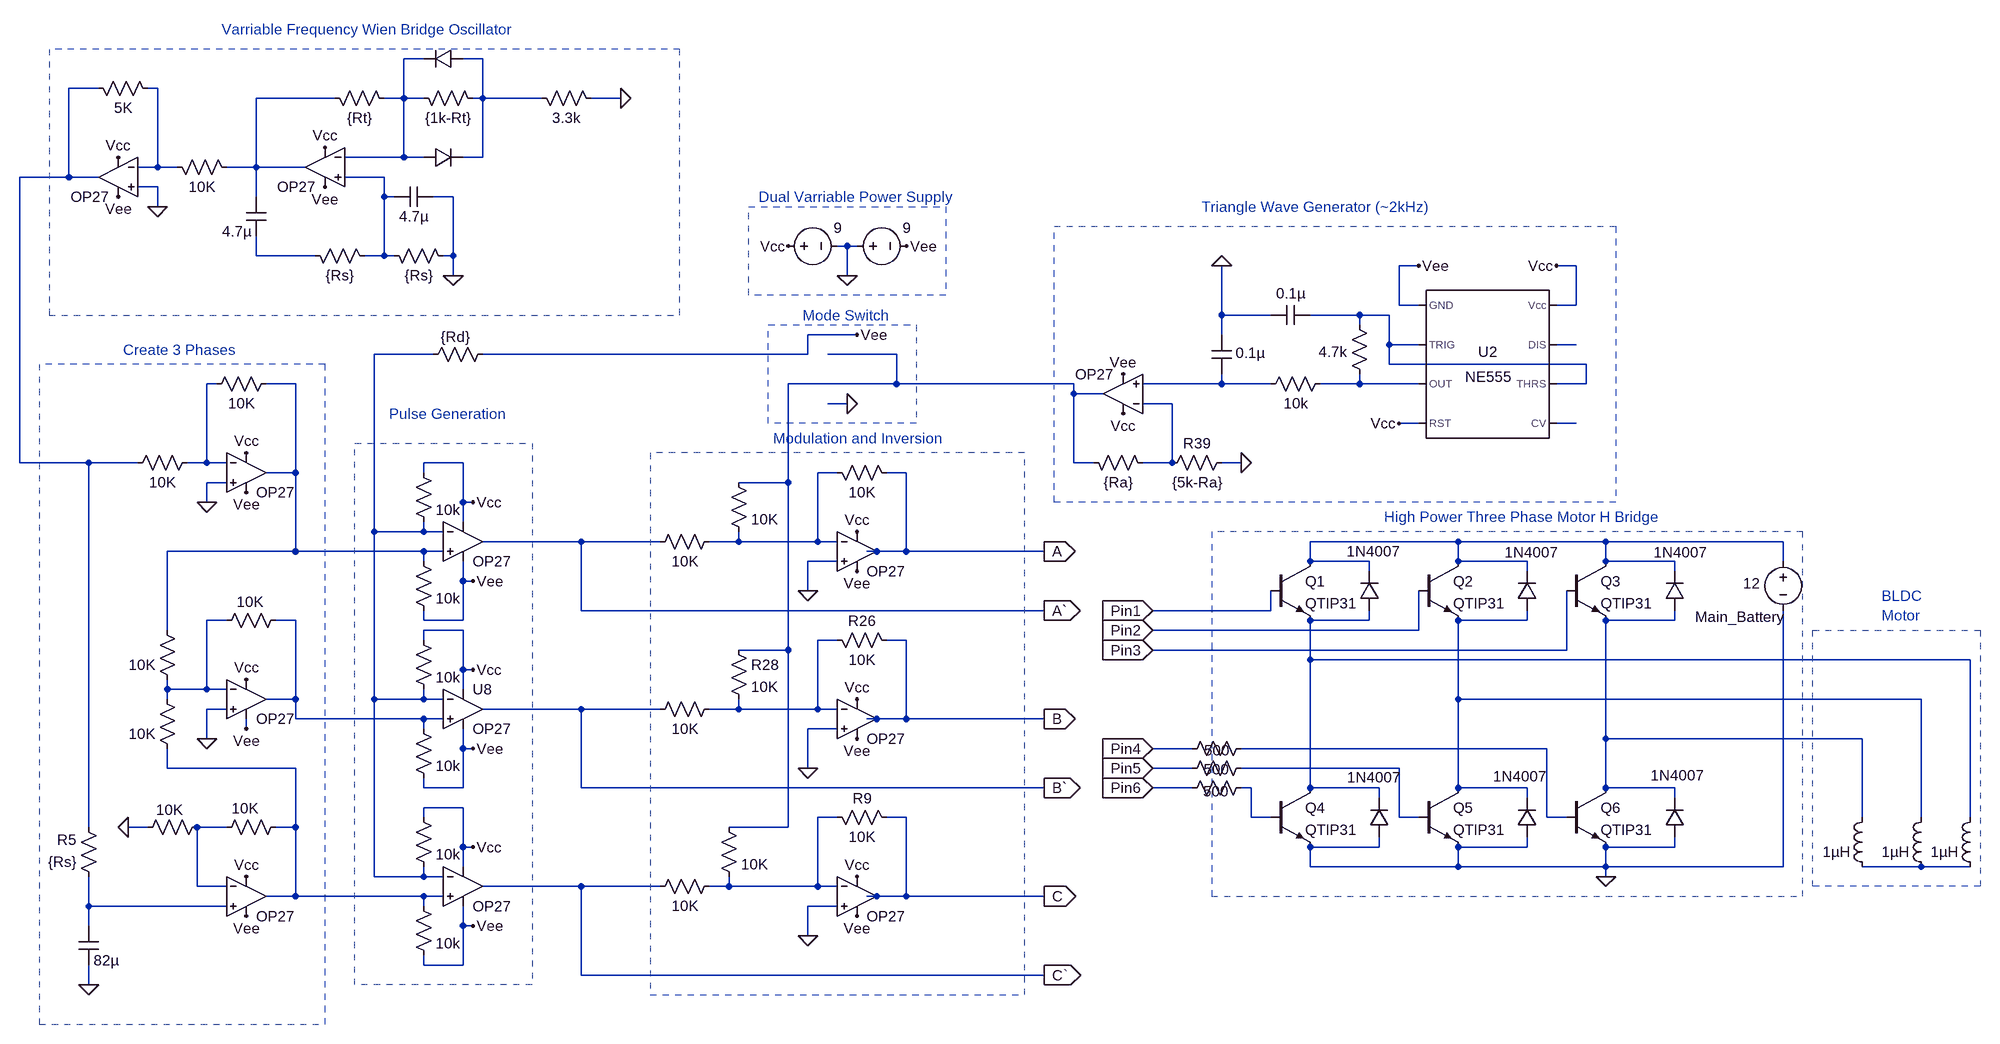
[diagram p0: schematic Complete_Design.asc]
Complete_Design.asc, the LTspice schematic file:
Version 4
SHEET 1 4072 2576
WIRE 480 -128 448 -128
WIRE 576 -128 544 -128
WIRE -48 -80 -96 -80
WIRE 48 -80 32 -80
WIRE 336 -64 208 -64
WIRE 448 -64 448 -128
WIRE 448 -64 416 -64
WIRE 480 -64 448 -64
WIRE 576 -64 576 -128
WIRE 576 -64 560 -64
WIRE 672 -64 576 -64
WIRE 800 -64 752 -64
WIRE 448 32 448 -64
WIRE 448 32 352 32
WIRE 480 32 448 32
WIRE 576 32 576 -64
WIRE 576 32 544 32
WIRE 48 48 48 -80
WIRE 48 48 16 48
WIRE 80 48 48 48
WIRE 208 48 208 -64
WIRE 208 48 160 48
WIRE 288 48 208 48
WIRE -96 64 -96 -80
WIRE -96 64 -176 64
WIRE -48 64 -96 64
WIRE 416 64 352 64
WIRE 48 80 16 80
WIRE 208 96 208 48
WIRE 416 96 416 64
WIRE 432 96 416 96
WIRE 528 96 496 96
WIRE 48 112 48 80
WIRE 1168 176 1152 176
WIRE 1184 176 1168 176
WIRE 208 192 208 160
WIRE 304 192 208 192
WIRE 416 192 416 96
WIRE 416 192 384 192
WIRE 432 192 416 192
WIRE 528 192 528 96
WIRE 528 192 512 192
WIRE 2096 208 2064 208
WIRE 2352 208 2320 208
WIRE 528 224 528 192
WIRE 1168 224 1168 176
WIRE 2064 272 2064 208
WIRE 2096 272 2064 272
WIRE 2352 272 2352 208
WIRE 2352 272 2320 272
WIRE 1776 288 1776 208
WIRE 1856 288 1776 288
WIRE 2000 288 1920 288
WIRE 2048 288 2000 288
WIRE 2000 304 2000 288
WIRE 1184 320 1104 320
WIRE 1776 320 1776 288
WIRE 2048 336 2048 288
WIRE 2096 336 2048 336
WIRE 2352 336 2320 336
WIRE 496 352 400 352
WIRE 1104 352 1104 320
WIRE 1104 352 576 352
WIRE 1248 352 1136 352
WIRE 2048 368 2048 336
WIRE 2368 368 2048 368
WIRE 144 400 128 400
WIRE 272 400 224 400
WIRE 1248 400 1248 352
WIRE 1248 400 1072 400
WIRE 1536 400 1248 400
WIRE 1776 400 1776 384
WIRE 1776 400 1648 400
WIRE 1856 400 1776 400
WIRE 2000 400 2000 384
WIRE 2000 400 1936 400
WIRE 2096 400 2000 400
WIRE 2368 400 2368 368
WIRE 2368 400 2320 400
WIRE 1536 416 1536 400
WIRE 1584 416 1536 416
WIRE 1168 432 1136 432
WIRE 1696 432 1648 432
WIRE 2096 464 2064 464
WIRE 2352 464 2320 464
WIRE -176 528 -176 64
WIRE -64 528 -176 528
WIRE 16 528 -64 528
WIRE 128 528 128 400
WIRE 128 528 96 528
WIRE 160 528 128 528
WIRE 544 528 480 528
WIRE 1536 528 1536 416
WIRE 1568 528 1536 528
WIRE 1696 528 1696 432
WIRE 1696 528 1648 528
WIRE 1808 528 1776 528
WIRE 272 544 272 400
WIRE 272 544 224 544
WIRE 480 544 480 528
WIRE 1152 544 1120 544
WIRE 1264 544 1232 544
WIRE 160 560 128 560
WIRE 1072 560 1072 400
WIRE 1072 560 992 560
WIRE 128 592 128 560
WIRE 544 592 544 528
WIRE 560 592 544 592
WIRE 544 624 544 592
WIRE 400 640 400 352
WIRE 480 640 480 624
WIRE 480 640 400 640
WIRE 512 640 480 640
WIRE 736 656 576 656
WIRE 864 656 736 656
WIRE 992 656 992 640
WIRE 992 656 944 656
WIRE 1120 656 1120 544
WIRE 1120 656 992 656
WIRE 1152 656 1120 656
WIRE 2160 656 1920 656
WIRE 2400 656 2160 656
WIRE 2688 656 2400 656
WIRE 272 672 272 544
WIRE 272 672 64 672
WIRE 480 672 272 672
WIRE 512 672 480 672
WIRE 1216 672 1200 672
WIRE 1264 672 1264 544
WIRE 1264 672 1216 672
WIRE 1488 672 1264 672
WIRE 480 688 480 672
WIRE 1152 688 1104 688
WIRE 1920 688 1920 656
WIRE 2016 688 1920 688
WIRE 2160 688 2160 656
WIRE 2272 688 2160 688
WIRE 2400 688 2400 656
WIRE 2512 688 2400 688
WIRE 2688 688 2688 656
WIRE 2016 704 2016 688
WIRE 2272 704 2272 688
WIRE 2512 704 2512 688
WIRE 544 720 544 688
WIRE 560 720 544 720
WIRE 1104 736 1104 688
WIRE 736 768 736 656
WIRE 1488 768 736 768
WIRE 1856 768 1856 736
WIRE 1856 768 1664 768
WIRE 160 784 128 784
WIRE 272 784 240 784
WIRE 480 784 480 768
WIRE 544 784 544 720
WIRE 544 784 480 784
WIRE 2016 784 2016 768
WIRE 2016 784 1920 784
WIRE 2272 784 2272 768
WIRE 2272 784 2160 784
WIRE 2512 784 2512 768
WIRE 2512 784 2400 784
WIRE 64 800 64 672
WIRE 544 800 480 800
WIRE 2096 800 2096 736
WIRE 2096 800 1664 800
WIRE 480 816 480 800
WIRE 1152 816 1120 816
WIRE 1264 816 1232 816
WIRE 1072 832 1072 560
WIRE 1072 832 992 832
WIRE 2336 832 2336 736
WIRE 2336 832 1664 832
WIRE 1920 848 1920 784
WIRE 2992 848 1920 848
WIRE 544 864 544 800
WIRE 560 864 544 864
WIRE 64 896 64 880
WIRE 128 896 128 784
WIRE 128 896 64 896
WIRE 160 896 128 896
WIRE 544 896 544 864
WIRE 64 912 64 896
WIRE 272 912 272 784
WIRE 272 912 224 912
WIRE 400 912 400 640
WIRE 480 912 480 896
WIRE 480 912 400 912
WIRE 512 912 480 912
WIRE 2160 912 2160 784
WIRE 2912 912 2160 912
WIRE 160 928 128 928
WIRE 736 928 576 928
WIRE 864 928 736 928
WIRE 992 928 992 912
WIRE 992 928 944 928
WIRE 1120 928 1120 816
WIRE 1120 928 992 928
WIRE 1152 928 1120 928
WIRE 272 944 272 912
WIRE 480 944 272 944
WIRE 512 944 480 944
WIRE 1216 944 1200 944
WIRE 1264 944 1264 816
WIRE 1264 944 1216 944
WIRE 1488 944 1264 944
WIRE 192 960 192 944
WIRE 480 960 480 944
WIRE 1152 960 1104 960
WIRE 128 976 128 928
WIRE 2400 976 2400 784
WIRE 2816 976 2400 976
WIRE 544 992 544 960
WIRE 560 992 544 992
WIRE 1728 992 1664 992
WIRE 2304 992 1808 992
WIRE 64 1024 64 992
WIRE 272 1024 64 1024
WIRE 1104 1024 1104 960
WIRE 1728 1024 1664 1024
WIRE 2064 1024 1808 1024
WIRE 480 1056 480 1040
WIRE 544 1056 544 992
WIRE 544 1056 480 1056
WIRE 736 1056 736 928
WIRE 1488 1056 736 1056
WIRE 1728 1056 1664 1056
WIRE 1824 1056 1808 1056
WIRE 1920 1056 1920 848
WIRE 2032 1056 1920 1056
WIRE 2160 1056 2160 912
WIRE 2272 1056 2160 1056
WIRE 2400 1056 2400 976
WIRE 2512 1056 2400 1056
WIRE 2032 1072 2032 1056
WIRE 2272 1072 2272 1056
WIRE 2512 1072 2512 1056
WIRE 544 1088 480 1088
WIRE 480 1104 480 1088
WIRE 1152 1104 1120 1104
WIRE 1264 1104 1232 1104
WIRE 1824 1104 1824 1056
WIRE 1856 1104 1824 1104
WIRE 2064 1104 2064 1024
WIRE 2096 1104 2064 1104
WIRE 2304 1104 2304 992
WIRE 2336 1104 2304 1104
WIRE 2816 1104 2816 976
WIRE 2912 1104 2912 912
WIRE 2992 1104 2992 848
WIRE -64 1120 -64 528
WIRE 32 1120 0 1120
WIRE 160 1120 112 1120
WIRE 272 1120 272 1024
WIRE 272 1120 240 1120
WIRE 1072 1120 1072 832
WIRE 1072 1120 976 1120
WIRE 544 1152 544 1088
WIRE 560 1152 544 1152
WIRE 2032 1152 2032 1136
WIRE 2032 1152 1920 1152
WIRE 2272 1152 2272 1136
WIRE 2272 1152 2160 1152
WIRE 2512 1152 2512 1136
WIRE 2512 1152 2400 1152
WIRE 544 1184 544 1152
WIRE 1920 1184 1920 1152
WIRE 2160 1184 2160 1152
WIRE 2160 1184 1920 1184
WIRE 2400 1184 2400 1152
WIRE 2400 1184 2160 1184
WIRE 2688 1184 2688 768
WIRE 2688 1184 2400 1184
WIRE 2912 1184 2816 1184
WIRE 2992 1184 2912 1184
WIRE 400 1200 400 912
WIRE 480 1200 480 1184
WIRE 480 1200 400 1200
WIRE 512 1200 480 1200
WIRE 2400 1200 2400 1184
WIRE 112 1216 112 1120
WIRE 160 1216 112 1216
WIRE 736 1216 576 1216
WIRE 864 1216 736 1216
WIRE 976 1216 976 1200
WIRE 976 1216 944 1216
WIRE 1120 1216 1120 1104
WIRE 1120 1216 976 1216
WIRE 1152 1216 1120 1216
WIRE 272 1232 272 1120
WIRE 272 1232 224 1232
WIRE 480 1232 272 1232
WIRE 512 1232 480 1232
WIRE 1216 1232 1200 1232
WIRE 1264 1232 1264 1104
WIRE 1264 1232 1216 1232
WIRE 1488 1232 1264 1232
WIRE -64 1248 -64 1200
WIRE 160 1248 -64 1248
WIRE 480 1248 480 1232
WIRE 1152 1248 1104 1248
WIRE -64 1280 -64 1248
WIRE 544 1280 544 1248
WIRE 560 1280 544 1280
WIRE 1104 1296 1104 1248
WIRE 480 1344 480 1328
WIRE 544 1344 544 1280
WIRE 544 1344 480 1344
WIRE 736 1360 736 1216
WIRE 1488 1360 736 1360
WIRE -64 1376 -64 1344
FLAG 320 80 Vee
FLAG 320 16 Vcc
FLAG 800 -64 0
FLAG 528 224 0
FLAG 1776 208 0
FLAG 2096 208 Vee
FLAG 2320 208 Vcc
FLAG 2064 464 Vcc
FLAG 128 592 0
FLAG 192 512 Vcc
FLAG 192 880 Vcc
FLAG 192 1200 Vcc
FLAG 0 1120 0
FLAG 1072 176 Vcc
FLAG 1168 224 0
FLAG 1264 176 Vee
FLAG 192 960 Vee
FLAG 192 1264 Vee
FLAG 192 576 Vee
FLAG 128 976 0
FLAG 560 720 Vee
FLAG 560 592 Vcc
FLAG 560 992 Vee
FLAG 560 864 Vcc
FLAG 560 1280 Vee
FLAG 560 1152 Vcc
FLAG 48 112 0
FLAG -16 32 Vcc
FLAG -16 96 Vee
FLAG -64 1376 0
FLAG 2400 1200 0
FLAG 1616 448 Vcc
FLAG 1808 528 0
FLAG 1616 384 Vee
FLAG 1184 912 Vcc
FLAG 1184 976 Vee
FLAG 1104 1024 0
FLAG 1184 640 Vcc
FLAG 1184 704 Vee
FLAG 1104 736 0
FLAG 1184 1200 Vcc
FLAG 1184 1264 Vee
FLAG 1104 1296 0
FLAG 1168 432 0
FLAG 1184 320 Vee
FLAG 1488 672 A
IOPIN 1488 672 Out
FLAG 1488 768 A`
IOPIN 1488 768 Out
FLAG 1488 944 B
IOPIN 1488 944 Out
FLAG 1488 1056 B`
IOPIN 1488 1056 Out
FLAG 1488 1232 C
IOPIN 1488 1232 Out
FLAG 1488 1360 C`
IOPIN 1488 1360 Out
FLAG 1664 768 Pin1
IOPIN 1664 768 In
FLAG 1664 800 Pin2
IOPIN 1664 800 In
FLAG 1664 832 Pin3
IOPIN 1664 832 In
FLAG 1664 992 Pin4
IOPIN 1664 992 In
FLAG 1664 1024 Pin5
IOPIN 1664 1024 In
FLAG 1664 1056 Pin6
IOPIN 1664 1056 In
SYMBOL Opamps\\OP27 320 -16 M0
WINDOW 0 16 32 Invisible 2
SYMATTR InstName U1
SYMBOL res 768 -48 M270
WINDOW 0 32 56 Invisible 2
WINDOW 3 0 56 VBottom 2
SYMATTR InstName R1
SYMATTR Value 3.3k
SYMBOL res 576 -48 M270
WINDOW 0 32 56 Invisible 2
WINDOW 3 0 56 VBottom 2
SYMATTR InstName R2
SYMATTR Value {1k-Rt}
SYMBOL cap 224 96 M0
WINDOW 0 24 8 Invisible 2
SYMATTR InstName C1
SYMATTR Value 4.7µ
SYMBOL cap 432 80 M90
WINDOW 0 0 32 Invisible 2
WINDOW 3 32 32 VTop 2
SYMATTR InstName C2
SYMATTR Value 4.7µ
SYMBOL diode 544 -112 M270
WINDOW 0 32 32 Invisible 2
WINDOW 3 0 32 Invisible 2
SYMATTR InstName D1
SYMATTR Value 1N4007
SYMBOL diode 480 16 M90
WINDOW 0 0 32 Invisible 2
WINDOW 3 32 32 Invisible 2
SYMATTR InstName D2
SYMATTR Value 1N4007
SYMBOL Misc\\NE555 2208 368 R0
SYMATTR InstName U2
SYMBOL res 1952 384 R90
WINDOW 0 0 56 Invisible 2
WINDOW 3 32 56 VTop 2
SYMATTR InstName R7
SYMATTR Value 10k
SYMBOL cap 1792 384 R180
WINDOW 0 24 56 Invisible 2
WINDOW 3 -54 35 Left 2
SYMATTR InstName C3
SYMATTR Value 0.1µ
SYMBOL res 2016 400 R180
WINDOW 0 36 76 Invisible 2
WINDOW 3 37 52 Left 2
SYMATTR InstName R8
SYMATTR Value 4.7k
SYMBOL cap 1856 304 R270
WINDOW 0 32 32 Invisible 2
WINDOW 3 67 32 VBottom 2
SYMATTR InstName C4
SYMATTR Value 0.1µ
SYMBOL res 1552 512 M90
WINDOW 0 0 56 Invisible 2
WINDOW 3 32 56 VTop 2
SYMATTR InstName R10
SYMATTR Value {Ra}
SYMBOL Opamps\\OP27 192 480 R0
WINDOW 0 16 32 Invisible 2
SYMATTR InstName U4
SYMBOL Opamps\\OP27 192 848 R0
WINDOW 0 16 32 Invisible 2
SYMATTR InstName U5
SYMBOL Opamps\\OP27 192 1168 R0
WINDOW 0 16 32 Invisible 2
SYMATTR InstName U6
SYMBOL res 112 512 R90
WINDOW 0 0 56 Invisible 2
WINDOW 3 32 56 VTop 2
SYMATTR InstName R11
SYMATTR Value 10K
SYMBOL res 240 384 R90
WINDOW 0 0 56 Invisible 2
WINDOW 3 32 56 VTop 2
SYMATTR InstName R12
SYMATTR Value 10K
SYMBOL res 256 768 R90
WINDOW 0 0 56 Invisible 2
WINDOW 3 -30 58 VTop 2
SYMATTR InstName R13
SYMATTR Value 10K
SYMBOL res 256 1104 R90
WINDOW 0 0 56 Invisible 2
WINDOW 3 -31 66 VTop 2
SYMATTR InstName R14
SYMATTR Value 10K
SYMBOL res 128 1104 R90
WINDOW 0 0 56 Invisible 2
WINDOW 3 -28 61 VTop 2
SYMATTR InstName R15
SYMATTR Value 10K
SYMBOL voltage 1056 176 R270
WINDOW 0 24 16 Invisible 2
WINDOW 3 30 90 VRight 2
WINDOW 123 0 0 Left 2
WINDOW 39 0 0 Left 2
SYMATTR InstName V1
SYMATTR Value 9
SYMBOL voltage 1168 176 R270
WINDOW 0 24 16 Invisible 2
WINDOW 3 30 90 VRight 2
WINDOW 123 0 0 Left 2
WINDOW 39 0 0 Left 2
SYMATTR InstName V2
SYMATTR Value 9
SYMBOL Opamps\\OP27 544 592 R0
WINDOW 0 16 32 Invisible 2
SYMATTR InstName U7
SYMBOL res 464 528 R0
WINDOW 0 36 40 Invisible 2
SYMATTR InstName R16
SYMATTR Value 10k
SYMBOL res 464 672 R0
WINDOW 0 36 40 Invisible 2
SYMATTR InstName R17
SYMATTR Value 10k
SYMBOL Opamps\\OP27 544 864 R0
SYMATTR InstName U8
SYMBOL res 464 800 R0
WINDOW 0 36 40 Invisible 2
SYMATTR InstName R18
SYMATTR Value 10k
SYMBOL res 464 944 R0
WINDOW 0 36 40 Invisible 2
SYMATTR InstName R19
SYMATTR Value 10k
SYMBOL Opamps\\OP27 544 1152 R0
WINDOW 0 16 32 Invisible 2
SYMATTR InstName U9
SYMBOL res 464 1088 R0
WINDOW 0 36 40 Invisible 2
SYMATTR InstName R20
SYMATTR Value 10k
SYMBOL res 464 1232 R0
WINDOW 0 36 40 Invisible 2
SYMATTR InstName R21
SYMATTR Value 10k
SYMBOL res 80 896 R180
WINDOW 0 36 76 Invisible 2
WINDOW 3 36 40 Left 2
SYMATTR InstName R22
SYMATTR Value 10K
SYMBOL res 80 1008 R180
WINDOW 0 36 76 Invisible 2
WINDOW 3 36 40 Left 2
SYMATTR InstName R23
SYMATTR Value 10K
SYMBOL Opamps\\OP27 -16 0 M0
WINDOW 0 16 32 Invisible 2
SYMATTR InstName U10
SYMBOL res 64 32 M90
WINDOW 0 0 56 Invisible 2
WINDOW 3 32 56 VTop 2
SYMATTR InstName R24
SYMATTR Value 10K
SYMBOL res -64 -96 M90
WINDOW 0 0 56 Invisible 2
WINDOW 3 32 56 VTop 2
SYMATTR InstName R25
SYMATTR Value 5K
SYMBOL cap -80 1280 R0
WINDOW 0 24 8 Invisible 2
SYMATTR InstName C5
SYMATTR Value 82µ
SYMBOL voltage 2688 672 M0
WINDOW 123 0 0 Left 2
WINDOW 39 0 0 Left 2
WINDOW 0 143 106 Right 2
WINDOW 3 65 52 Right 2
SYMATTR InstName Main_Battery
SYMATTR Value 12
SYMBOL res 416 176 M90
WINDOW 0 0 56 Invisible 2
WINDOW 3 32 56 VTop 2
SYMATTR InstName R4
SYMATTR Value {Rs}
SYMBOL res 288 176 M90
WINDOW 0 0 56 Invisible 2
WINDOW 3 32 56 VTop 2
SYMATTR InstName R3
SYMATTR Value {Rs}
SYMBOL res -48 1216 R180
WINDOW 0 36 76 Left 2
WINDOW 3 36 40 Left 2
SYMATTR InstName R5
SYMATTR Value {Rs}
SYMBOL ind 3008 1200 R180
WINDOW 0 36 80 Invisible 2
WINDOW 3 36 40 Left 2
SYMATTR InstName L1
SYMATTR Value 1µH
SYMATTR SpiceLine Ipk=0.8 Rser=0.01
SYMBOL ind 2928 1200 R180
WINDOW 0 36 80 Invisible 2
WINDOW 3 36 40 Left 2
SYMATTR InstName L2
SYMATTR Value 1µH
SYMATTR SpiceLine Ipk=0.8 Rser=0.01
SYMBOL ind 2832 1200 R180
WINDOW 0 36 80 Invisible 2
WINDOW 3 36 40 Left 2
SYMATTR InstName L3
SYMATTR Value 1µH
SYMATTR SpiceLine Ipk=0.8 Rser=0.01
SYMBOL diode 2000 768 M180
WINDOW 0 24 64 Invisible 2
WINDOW 3 -21 96 Left 2
SYMATTR InstName D3
SYMATTR Value 1N4007
SYMBOL diode 2256 768 M180
WINDOW 0 24 64 Invisible 2
WINDOW 3 -20 95 Left 2
SYMATTR InstName D4
SYMATTR Value 1N4007
SYMBOL diode 2496 768 M180
WINDOW 0 24 64 Invisible 2
WINDOW 3 -18 95 Left 2
SYMATTR InstName D5
SYMATTR Value 1N4007
SYMBOL diode 2496 1136 M180
WINDOW 0 24 64 Invisible 2
WINDOW 3 -23 101 Left 2
SYMATTR InstName D6
SYMATTR Value 1N4007
SYMBOL diode 2256 1136 M180
WINDOW 0 24 64 Invisible 2
WINDOW 3 -39 99 Left 2
SYMATTR InstName D7
SYMATTR Value 1N4007
SYMBOL diode 2016 1136 M180
WINDOW 0 24 64 Invisible 2
WINDOW 3 -36 97 Left 2
SYMATTR InstName D8
SYMATTR Value 1N4007
SYMBOL res 848 1232 R270
WINDOW 0 32 56 Invisible 2
WINDOW 3 0 56 VBottom 2
SYMATTR InstName R36
SYMATTR Value 10K
SYMBOL res 592 336 R90
WINDOW 0 0 56 Invisible 2
WINDOW 3 -28 61 VTop 2
SYMATTR InstName R6
SYMATTR Value {Rd}
SYMBOL res 960 1104 R0
WINDOW 0 36 40 Invisible 2
SYMATTR InstName R33
SYMATTR Value 10K
SYMBOL npn 1856 688 R0
SYMATTR InstName Q1
SYMATTR Value QTIP31
SYMBOL npn 2096 688 R0
SYMATTR InstName Q2
SYMATTR Value QTIP31
SYMBOL npn 2336 688 R0
SYMATTR InstName Q3
SYMATTR Value QTIP31
SYMBOL npn 1856 1056 R0
SYMATTR InstName Q4
SYMATTR Value QTIP31
SYMBOL npn 2096 1056 R0
SYMATTR InstName Q5
SYMATTR Value QTIP31
SYMBOL npn 2336 1056 R0
SYMATTR InstName Q6
SYMATTR Value QTIP31
SYMBOL Opamps\\OP27 1616 480 R180
WINDOW 0 16 32 Invisible 2
SYMATTR InstName U13
SYMBOL res 1680 544 R270
WINDOW 0 32 56 VTop 2
WINDOW 3 0 56 VBottom 2
SYMATTR InstName R39
SYMATTR Value {5k-Ra}
SYMBOL res 1248 832 M270
WINDOW 0 32 56 VTop 2
WINDOW 3 0 56 VBottom 2
SYMATTR InstName R26
SYMATTR Value 10K
SYMBOL res 976 816 R0
SYMATTR InstName R28
SYMATTR Value 10K
SYMBOL Opamps\\OP27 1184 880 R0
WINDOW 0 16 32 Invisible 2
SYMATTR InstName U3
SYMBOL res 960 912 R90
WINDOW 0 0 56 Invisible 2
WINDOW 3 32 56 VTop 2
SYMATTR InstName R27
SYMATTR Value 10K
SYMBOL res 1248 560 M270
WINDOW 0 32 56 Invisible 2
WINDOW 3 0 56 VBottom 2
SYMATTR InstName R29
SYMATTR Value 10K
SYMBOL res 976 544 R0
WINDOW 0 36 40 Invisible 2
SYMATTR InstName R30
SYMATTR Value 10K
SYMBOL Opamps\\OP27 1184 608 R0
WINDOW 0 16 32 Invisible 2
SYMATTR InstName U11
SYMBOL res 960 640 R90
WINDOW 0 0 56 Invisible 2
WINDOW 3 32 56 VTop 2
SYMATTR InstName R32
SYMATTR Value 10K
SYMBOL res 1248 1120 M270
WINDOW 0 32 56 VTop 2
WINDOW 3 0 56 VBottom 2
SYMATTR InstName R9
SYMATTR Value 10K
SYMBOL Opamps\\OP27 1184 1168 R0
WINDOW 0 16 32 Invisible 2
SYMATTR InstName U12
SYMBOL res 1824 1040 R90
WINDOW 0 0 56 Invisible 2
WINDOW 3 6 58 VTop 2
SYMATTR InstName R31
SYMATTR Value 500
SYMBOL res 1824 1008 R90
WINDOW 0 0 56 Invisible 2
WINDOW 3 2 57 VTop 2
SYMATTR InstName R34
SYMATTR Value 500
SYMBOL res 1824 976 R90
WINDOW 0 0 56 Invisible 2
WINDOW 3 3 56 VTop 2
SYMATTR InstName R35
SYMATTR Value 500
SYMBOL res 432 -48 M270
WINDOW 0 32 56 Invisible 2
WINDOW 3 0 56 VBottom 2
SYMATTR InstName R37
SYMATTR Value {Rt}
TEXT 616 -176 Right 2 ;Varriable Frequency Wien Bridge Oscillator
TEXT 1744 112 Left 2 ;Triangle Wave Generator (~2kHz)
TEXT -8 344 Left 2 ;Create 3 Phases
TEXT 424 448 Left 2 ;Pulse Generation
TEXT 2040 616 Left 2 ;High Power Three Phase Motor H Bridge
TEXT 2848 744 Left 2 ;BLDC\nMotor
TEXT 1048 488 Left 2 ;Modulation and Inversion
TEXT 1024 96 Left 2 ;Dual Varriable Power Supply
TEXT 1096 288 Left 2 ;Mode Switch
RECTANGLE Normal 2416 592 1504 144 2
RECTANGLE Normal -128 288 896 -144 2
RECTANGLE Normal -144 1440 320 368 2
RECTANGLE Normal 656 1376 368 496 2
RECTANGLE Normal 1760 1232 2720 640 2
RECTANGLE Normal 3008 1216 2736 800 2
RECTANGLE Normal 848 1392 1456 512 2
RECTANGLE Normal 1328 256 1008 112 2
RECTANGLE Normal 1280 464 1040 304 2

The netlist it stands for:
* Complete_Design.asc
XU1 N006 N001 Vcc Vee N005 OP27  ; pins In+ In- V+ V- OUT
R1 0 N002 3.3k
R2 N002 N001 {1k-Rt}
C1 N005 N007 4.7µ
C2 N006 0 4.7µ
D1 N002 N001 1N4007
D2 N001 N002 1N4007
XU2 Vee N008 N015 Vcc N017 N008 N009 Vcc NE555  ; pins GND TRIG OUT RST CV THRS DIS Vcc
R7 N015 N014 10k
C3 N014 0 0.1µ
R8 N015 N008 4.7k
C4 0 N008 0.1µ
R10 N011 N016 {Ra}
XU4 0 N012 Vcc Vee N013 OP27  ; pins In+ In- V+ V- OUT
XU5 0 N020 Vcc Vee N021 OP27  ; pins In+ In- V+ V- OUT
XU6 N033 N031 Vcc Vee N027 OP27  ; pins In+ In- V+ V- OUT
R11 N012 N003 10K
R12 N013 N012 10K
R13 N021 N020 10K
R14 N027 N031 10K
R15 N031 0 10K
V1 Vcc 0 9
V2 0 Vee 9
XU7 N013 N010 Vcc Vee A` OP27  ; pins In+ In- V+ V- OUT
R16 Vcc N010 10k
R17 N013 Vee 10k
XU8 N021 N010 Vcc Vee B` OP27  ; pins In+ In- V+ V- OUT
R18 Vcc N010 10k
R19 N021 Vee 10k
XU9 N027 N010 Vcc Vee C` OP27  ; pins In+ In- V+ V- OUT
R20 Vcc N010 10k
R21 N027 Vee 10k
R22 N020 N013 10K
R23 N027 N020 10K
XU10 0 N004 Vcc Vee N003 OP27  ; pins In+ In- V+ V- OUT
R24 N004 N005 10K
R25 N003 N004 5K
C5 N033 0 82µ
V§Main_Battery N019 0 12
R4 N006 0 {Rs}
R3 N007 N006 {Rs}
R5 N033 N003 {Rs}
L1 N032 N022 1µH Ipk=0.8 Rser=0.01
L2 N032 N023 1µH Ipk=0.8 Rser=0.01
L3 N032 N024 1µH Ipk=0.8 Rser=0.01
D3 N022 N019 1N4007
D4 N023 N019 1N4007
D5 N024 N019 1N4007
D6 0 N024 1N4007
D7 0 N023 1N4007
D8 0 N022 1N4007
R36 C` N030 10K
R6 Vee N010 {Rd}
R33 N011 N030 10K
Q1 N019 Pin1 N022 0 QTIP31
Q2 N019 Pin2 N023 0 QTIP31
Q3 N019 Pin3 N024 0 QTIP31
Q4 N022 N029 0 0 QTIP31
Q5 N023 N028 0 0 QTIP31
Q6 N024 N026 0 0 QTIP31
XU13 N014 N016 Vcc Vee N011 OP27  ; pins In+ In- V+ V- OUT
R39 N016 0 {5k-Ra}
R26 B N025 10K
R28 N011 N025 10K
XU3 0 N025 Vcc Vee B OP27  ; pins In+ In- V+ V- OUT
R27 N025 B` 10K
R29 A N018 10K
R30 N011 N018 10K
XU11 0 N018 Vcc Vee A OP27  ; pins In+ In- V+ V- OUT
R32 N018 A` 10K
R9 C N030 10K
XU12 0 N030 Vcc Vee C OP27  ; pins In+ In- V+ V- OUT
R31 N029 Pin6 500
R34 N028 Pin5 500
R35 N026 Pin4 500
R37 N001 N005 {Rt}
.model D D
.lib standard.dio
.model NPN NPN
.model PNP PNP
.lib standard.bjt
* Varriable Frequency Wien Bridge Oscillator
* Triangle Wave Generator (~2kHz)
* Create 3 Phases
* Pulse Generation
* High Power Three Phase Motor H Bridge
* BLDC
* Motor
* Modulation and Inversion
* Dual Varriable Power Supply
* Mode Switch
.lib ADI.lib
.lib NE555.sub
.backanno
.end